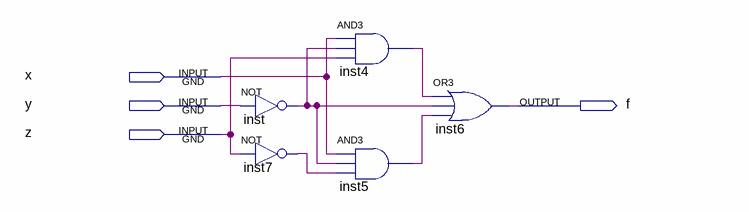
[diagram p0: schematic sheet]
// Quartus schematic 1-2-1.bdf as structural Verilog: 5 symbols, 4 pins
module \1-2-1  (
  input  x,
  input  y,
  input  z,
  output f
);

  wire inst4_out, inst5_out, inst7_out, inst_out;

  not inst (inst_out, y);
  not inst7 (inst7_out, z);
  and inst4 (inst4_out, x, inst_out, z);
  and inst5 (inst5_out, x, inst_out, inst7_out);
  or inst6 (f, inst4_out, inst_out, inst5_out);
endmodule
